# Altium schematic sheet Smart_OBD.SchDoc
size A3
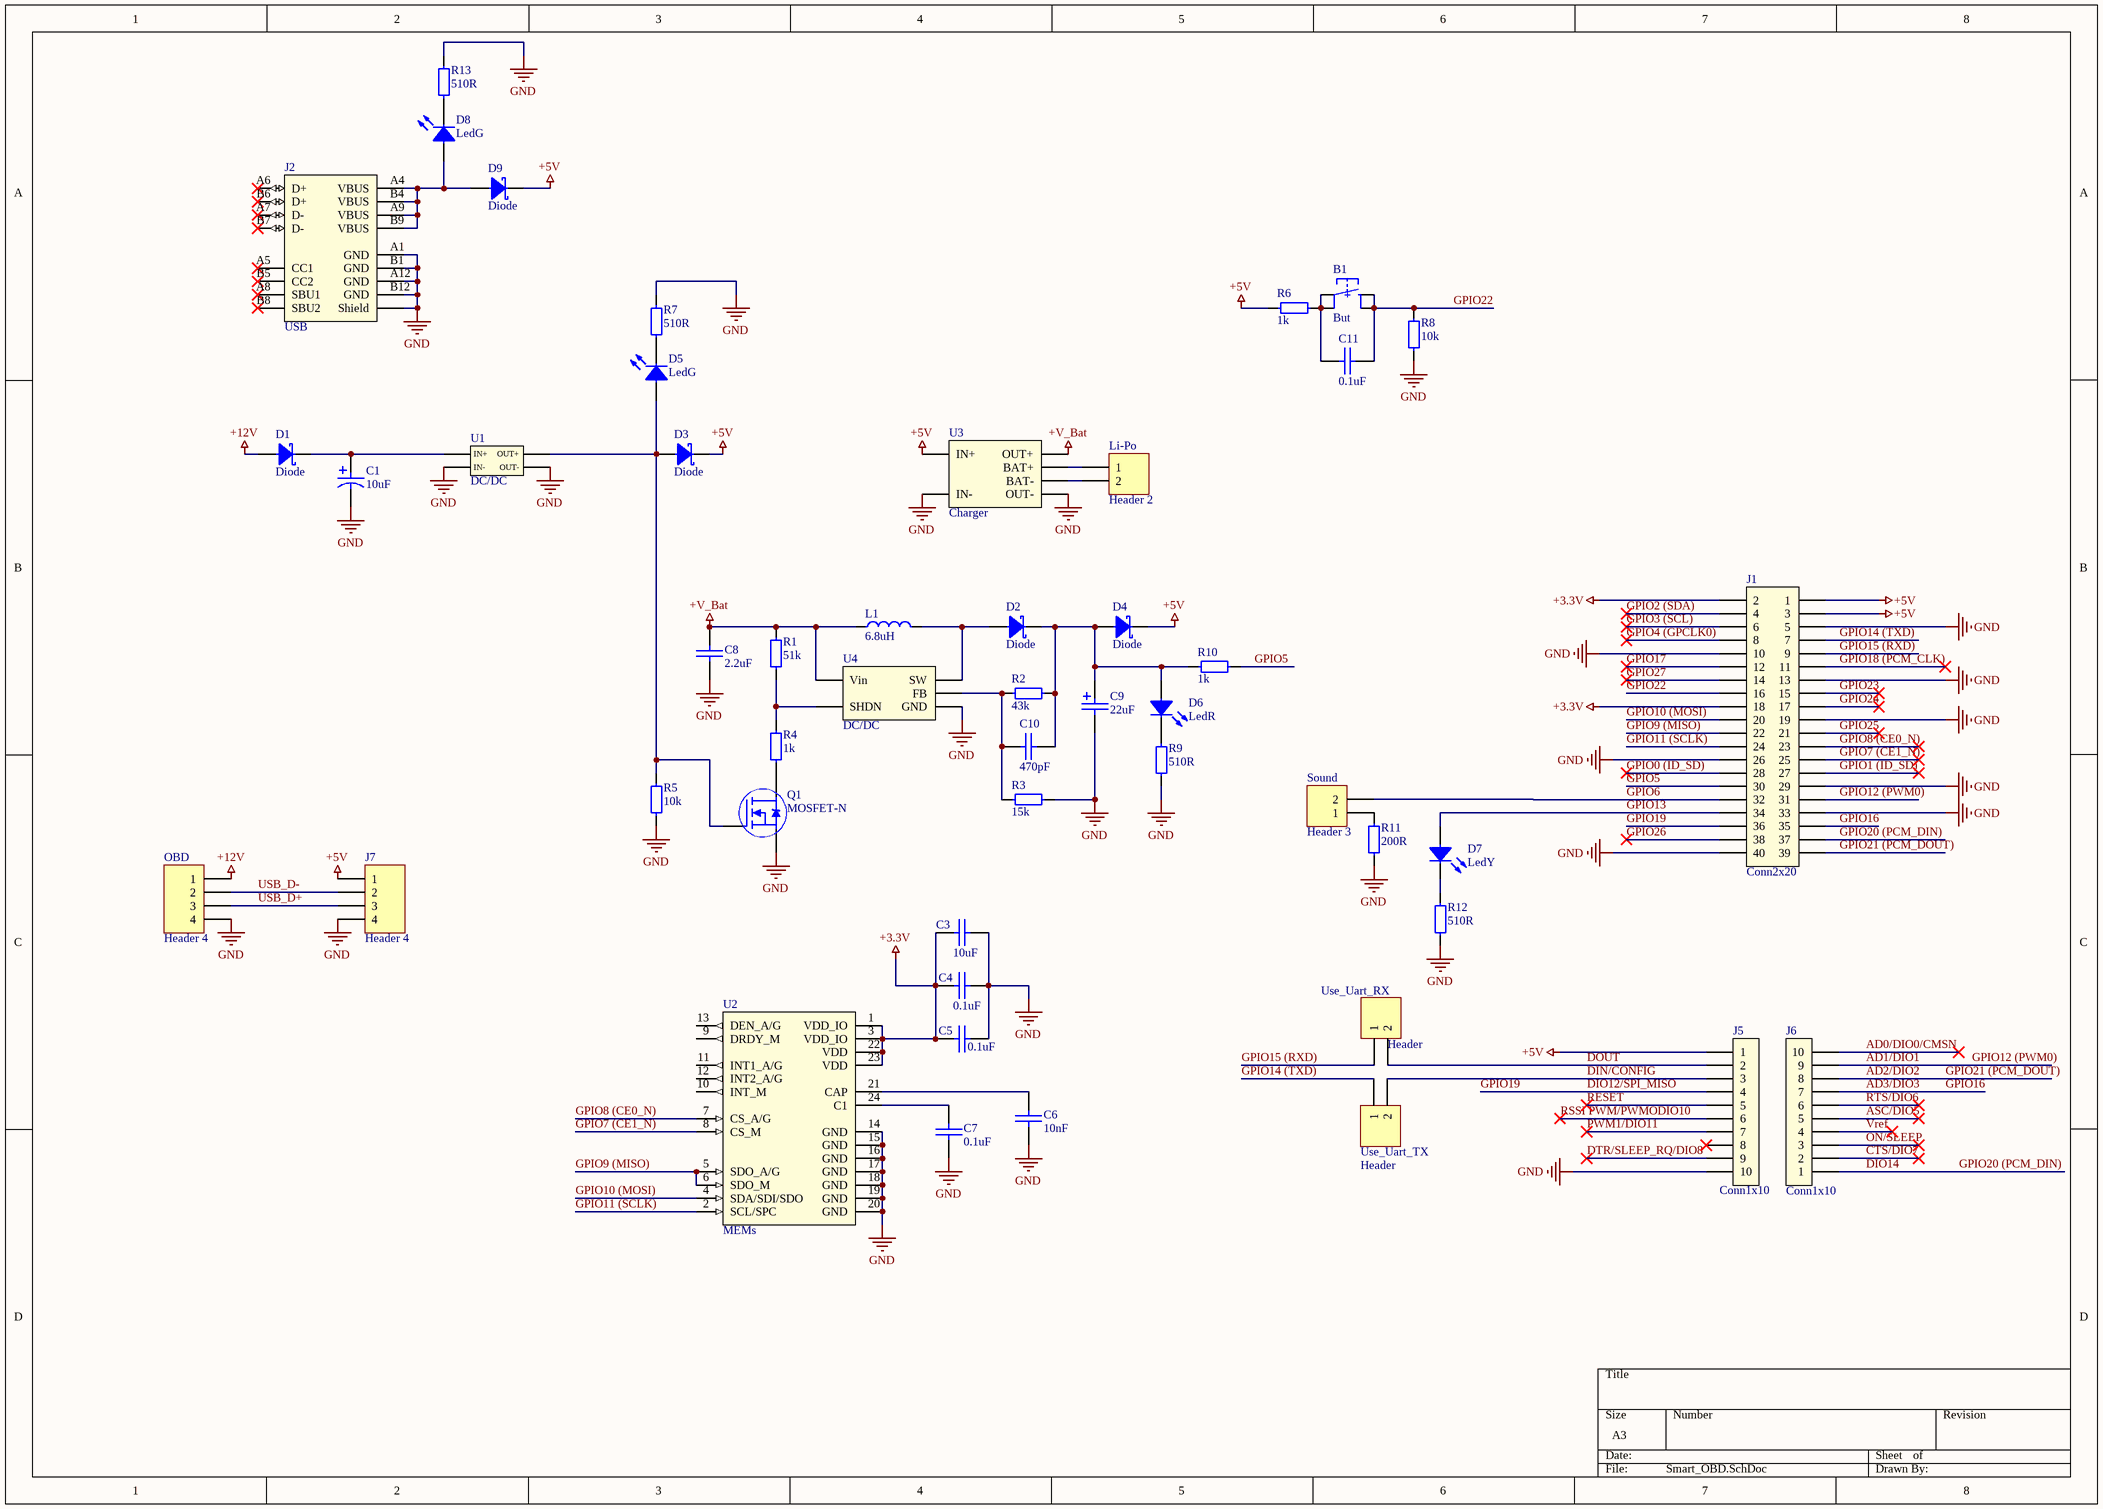
[diagram p0: Smart_OBD.SchDoc]

## Parts
B1  But  [Button 6x6]
C1  10uF  [Bar Cap 5x5.4]
C3  10uF  [0603 Capicator]
C4  0.1uF  [0603 Capicator]
C5  0.1uF  [0603 Capicator]
C6  10nF  [0603 Capicator]
C7  0.1uF  [0603 Capicator]
C8  2.2uF  [0603 Capicator]
C9  22uF  [TANTAL_C_CASE]
C10  470pF  [0603 Capicator]
C11  0.1uF  [0603 Capicator]
D1  Diode  [SMA]
D2  Diode  [SMA]
D3  Diode  [SMA]
D4  Diode  [SMA]
D5  LedG  [0805 LED]
D6  LedR  [0805 LED]
D7  LedY  [0805 LED]
D8  LedG  [0805 LED]
D9  Diode  [SMA]
J1  Conn2x20  [PBD 2x20]
J2  USB  [USB Type-C]
J5  Conn1x10  [PBS2 10]
J6  Conn1x10  [PBS2 10]
J7  Header 4  [HDR1X4]
L1  6.8uH  [Inductor 5.4x5.1]
Li-Po  Header 2  [HDR1X2]
OBD  Header 4  [HDR1X4]
Q1  MOSFET-N  [SOT-23]
R1  51k  [0603 Resistor]
R2  43k  [0603 Resistor]
R3  15k  [0603 Resistor]
R4  1k  [0603 Resistor]
R5  10k  [0603 Resistor]
R6  1k  [0603 Resistor]
R7  510R  [0603 Resistor]
R8  10k  [0603 Resistor]
R9  510R  [0603 Resistor]
R10  1k  [0603 Resistor]
R11  200R  [0603 Resistor]
R12  510R  [0603 Resistor]
R13  510R  [0603 Resistor]
Sound  Header 3  [HDR1X2]
U1  DC/DC  [DC-DC]
U2  MEMs  [LGA 3.5x3x1 mm 24-lead]
U3  Charger  [PW829]
U4  DC/DC  [SOT-23-5]
Use_Uart_RX  Header  [HDR1X2]
Use_Uart_TX  Header  [HDR1X2]

## Nets
+3.3V: C3.1 C4.1 C5.1 J1.2 J1.18 U2.1(VDD_IO) U2.3(VDD_IO) U2.22(VDD) U2.23(VDD)
+5V: D3.2 D4.2 D9.2 J1.1 J1.3 J5.1 J7.1 R6.1 U3.IN+
+12V: D1.1 OBD.1
+V_Bat: C8.2 L1.1 R1.2 U3.OUT+ U4.5(Vin)
GND: C1.1 C3.2 C4.2 C5.2 C6.2 C7.2 C8.1 C9.1 J1.5 J1.10 J1.13 J1.19 J1.26 J1.29 J1.33 J1.40 J2.A(Shield) J2.A1(GND) J2.A12(GND) J2.B1(GND) J2.B12(GND) J5.10 J7.4 OBD.4 Q1.2(Source) R3.2 R5.1 R7.2 R8.1 R9.2 R11.1 R12.2 R13.2 U1.1(IN-) U1.3(OUT-) U2.14(GND) U2.15(GND) U2.16(GND) U2.17(GND) U2.18(GND) U2.19(GND) U2.20(GND) U3.IN- U3.OUT- U4.2(GND)
AD0/DIO0/CMSN: J6.10
AD1/DIO1: J1.31 J6.9  [also labelled GPIO12 (PWM0)]
AD2/DIO2: J1.39 J6.8  [also labelled GPIO21 (PCM_DOUT)]
AD3/DIO3: J1.35 J6.7  [also labelled GPIO16]
ASC/DIO5: J6.5
CTS/DIO7: J6.2
DIN/CONFIG: J5.3 Use_Uart_TX.2
DIO12/SPI_MISO: J1.36 J5.4  [also labelled GPIO19]
DIO14: J1.37 J6.1  [also labelled GPIO20 (PCM_DIN)]
DOUT: J5.2 Use_Uart_RX.2
DTR/SLEEP_RQ/DIO8: J5.9
GPIO0 (ID_SD): J1.28
GPIO1 (ID_SD): J1.27
GPIO2 (SDA): J1.4
GPIO3 (SCL): J1.6
GPIO4 (GPCLK0): J1.8
GPIO5: J1.30 R10.1
GPIO6: J1.32 Sound.2
GPIO7 (CE1_N): J1.25 U2.8(CS_M)
GPIO8 (CE0_N): J1.23 U2.7(CS_A/G)
GPIO9 (MISO): J1.22 U2.5(SDO_A/G) U2.6(SDO_M)
GPIO10 (MOSI): J1.20 U2.4(SDA/SDI/SDO)
GPIO11 (SCLK): J1.24 U2.2(SCL/SPC)
GPIO13: D7.1 J1.34
GPIO14 (TXD): J1.7 Use_Uart_TX.1
GPIO15 (RXD): J1.9 Use_Uart_RX.1
GPIO17: J1.12
GPIO18 (PCM_CLK): J1.11
GPIO22: B1.3 B1.4 C11.2 J1.16 R8.2
GPIO23: J1.15
GPIO24: J1.17
GPIO25: J1.21
GPIO26: J1.38
GPIO27: J1.14
ON/SLEEP: J6.3
PWM1/DIO11: J5.7
RESET: J5.5
RSSI PWM/PWMODIO10: J5.6
RTS/DIO6: J6.6
USB_D+: J7.3 OBD.3
USB_D-: J7.2 OBD.2
Vref: J6.4
NetB1_1: B1.1 B1.2 C11.1 R6.2
NetC1_2: C1.2 D1.2 U1.2(IN+)
NetC6_1: C6.1 U2.21(CAP)
NetC7_1: C7.1 U2.24(C1)
NetC9_2: C9.2 C10.2 D2.2 D4.1 D6.1 R2.2 R10.2
NetC10_1: C10.1 R2.1 R3.1 U4.3(FB)
NetD2_1: D2.1 L1.2 U4.1(SW)
NetD3_1: D3.1 D5.1 Q1.1(Gate) R5.2 U1.4(OUT+)
NetD5_2: D5.2 R7.1
NetD6_2: D6.2 R9.1
NetD7_2: D7.2 R12.1
NetD8_1: D8.1 D9.1 J2.A4(VBUS) J2.A9(VBUS) J2.B4(VBUS) J2.B9(VBUS)
NetD8_2: D8.2 R13.1
NetLi-Po_1: Li-Po.1 U3.B+(BAT+)
NetLi-Po_2: Li-Po.2 U3.B-(BAT-)
NetQ1_3: Q1.3(Drain) R4.1
NetR1_1: R1.1 R4.2 U4.4(SHDN)
NetR11_2: R11.2 Sound.1

Not connected (* = marked no-connect by the designer): J2 A5(CC1)* A6(D+)* A7(D-)* A8(SBU1)* B5(CC2)* B6(D+)* B7(D-)* B8(SBU2)*; J5 8*; U2 9(DRDY_M) 10(INT_M) 11(INT1_A/G) 12(INT2_A/G) 13(DEN_A/G)

## Library data of the parts
B1 = Button 4 Conn: Button 4 Conn SMD; Manufacturer: TE Connectivity; Part Number: 1571563-9; Type: Button; ComponentLink1Description: Chip&Dip; ComponentLink1URL: https://www.chipdip.ru/product/tyco-1571563-9-fsm8jsmatr
C1 = Cap Pol 10uF: ECAP SMD,  35V; Part Number: ECAPSMD10uF/35V; Manufacturer: China; Type: Capacitor; ComponentLink1Description: Chip&Dip; ComponentLink1URL: https://www.chipdip.ru/product0/884555856
C3 = Cap 10uF (0603): 10uF X5R 25V 20% 0603; Manufacturer: Murata Manufacturing; Part Number: GRM188R61E106M; Type: Capacitor; ComponentLink1Description: Chip&Dip; ComponentLink1URL: https://www.chipdip.ru/product/grm188r61e106m
C4 C5 C7 C11 = Cap 0.1uF (0603): 0.1uF X7R 50V 10% 0603; Manufacturer: Murata Manufacturing; Part Number: GRM188R71H104KA93D; Type: Capacitor; ComponentLink1Description: Chip&Dip; ComponentLink1URL: https://www.chipdip.ru/product/grm188r71h104k
C6 = Cap 10nF (0603): X7R 10nF 100V 10% 0603; Manufacturer: Murata Manufacturing; Part Number: GRM188R72A103KA01D; Type: Capacitor; ComponentLink1Description: Chip&Dip; ComponentLink1URL: https://www.chipdip.ru/product/grm188r72a103ka01d
C8 = Cap 2.2uF (0603): 2.2uF X5R 10V 10% 0603; Manufacturer: Murata Manufacturing; Part Number: GRM188R61A225KE34D; Type: Capacitor; ComponentLink1Description: Chip&Dip; ComponentLink1URL: https://www.chipdip.ru/product/grm188r61a225k
C9 = Cap Tantal 22uF (SMDC): TECAP, 22uF, 16V, case C, 10%; Part Number: TECAP22/16VC10; Manufacturer: China; Type: Capacitor; ComponentLink1Description: Chip&Dip; ComponentLink1URL: https://www.chipdip.ru/product0/527359843
C10 = Cap 470pF (0603): 470pF NP0 50V 5% 0603; Manufacturer: Taiwan; Part Number: MLCC470pFNPO50V5%0603; Type: Capacitor; ComponentLink1Description: Chip&Dip; ComponentLink1URL: https://www.chipdip.ru/product0/515359566
D1-D4 D9 = Diode Schottky (SMA): Diode Schottky 3A 40V; Part Number: B340A-E3/61T; Manufacturer: Vishay; Type: Diode; ComponentLink1Description: DataSheet; ComponentLink1URL: https://static.chipdip.ru/lib/652/DOC001652710.pdf; ComponentLink2Description: Chip&Dip; ComponentLink2URL: https://www.chipdip.ru/product/b340a-e3-61t-2
D5 D8 = Led Green: Led Green SMD 1608, 120°, 525nM; Part Number: TO-1608BC-PG; Manufacturer: Taiwan Oasis Technology; Type: Diode; ComponentLink1Description: Chip&Dip; ComponentLink1URL: https://www.chipdip.ru/product/to-1608bc-pg
D6 = Led Red: SMD 1608, 112mcd, 120°, 630nM (Ultra Bright Red); Part Number: TO-1608BC-MRE; Manufacturer: Taiwan Oasis Technology; Type: Diode; ComponentLink1Description: Chip&Dip; ComponentLink1URL: https://www.chipdip.ru/product/to-1608bc-mre
D7 = Led Yellow: SMD 1608, 247mcd, 120°, 592nM (High Bright Yellow); Part Number: TO-1608BC-MYF; Manufacturer: Taiwan Oasis Technology; Type: Diode; ComponentLink1Description: Chip&Dip; ComponentLink1URL: https://www.chipdip.ru/product/to-1608bc-myf
J1 = Conn2x20 (PBD): Female for PLD; Part Number: DS1023-2*20S21; Manufacturer: Ningbo connfly electronic; Type: Connector; ComponentLink1Description: Chip&Dip; ComponentLink1URL: https://www.chipdip.ru/product/pbd-40
J2 = Connector USB 2.0 Type-C: Manufacturer: Global Connector Technology; Part Number: USB4085-GF-A; ComponentLink1Description: Chip&Dip; ComponentLink1URL: https://www.chipdip.ru/product/usb4085-gf-a; Type: Connector; ComponentLink2Description: DataSheet; ComponentLink2URL: https://www.farnell.com/cad/2648880.pdf
J5 J6 = Conn1x10 (PBS2): Female; Part Number: DS1026-01-1*10S8BV; Manufacturer: Ningbo connfly electronic; Type: Connector; ComponentLink1Description: Chip&Dip; ComponentLink1URL: https://www.chipdip.ru/product/pbs2-10
J7 OBD = Header 4: Header, 4-Pin; LatestRevisionDate: 17-Jul-2002; LatestRevisionNote: Re-released for DXP Platform.; Publisher: Altium Limited
L1 = Inductor 6.8uH (4.2A): 6.8uH, 5.4x5.1x2, 4.2A; Part Number: SPM5020T-3R3M-LR; Manufacturer: TDK; Type: Inductor; ComponentLink1Description: DataSheet; ComponentLink1URL: https://static.chipdip.ru/lib/015/DOC004015227.pdf; ComponentLink2Description: Chip&Dip; ComponentLink2URL: SPM5020T-6R8M-LR
Li-Po Sound Use_Uart_RX Use_Uart_TX = Header 2: Header, 2-Pin; LatestRevisionDate: 17-Jul-2002; LatestRevisionNote: Re-released for DXP Platform.; Publisher: Altium Limited
Q1 = MOSFET-N [FDV]: These N-Channel enhancement mode field effect transistors areproduced  using  Fairchild's  proprietary,  high  cell  density,  DMOStechnology.; Part Number: FDV303N; Manufacturer: Fairchild Semiconductor; Type: Transistor; ComponentLink1Description: DataSheet; ComponentLink1URL: https://static.chipdip.ru/lib/009/DOC001009115.pdf; ComponentLink2Description: Chip&Dip; ComponentLink2URL: https://www.chipdip.ru/product/fdv303n
R1 = Res 51k (0603): 0.1W 0603 51k, 1%; Part Number: RC0603FR-0751KL; Manufacturer: Taiwan; Type: Resistor; ComponentLink1Description: Chip&Dip; ComponentLink1URL: https://www.chipdip.ru/product0/9000079753
R2 = Res 43k (0603): 0.1W 0603 43k, 1%; Part Number: RC0603FR-0743KL; Manufacturer: Taiwan; Type: Resistor; ComponentLink1Description: Chip&Dip; ComponentLink1URL: https://www.chipdip.ru/product0/9000079751
R3 = Res 15k (0603): 0.1W 0603 15k, 1%; Part Number: RC0603FR-0715KL; Manufacturer: Taiwan; Type: Resistor; ComponentLink1Description: Chip&Dip; ComponentLink1URL: https://www.chipdip.ru/product0/9000079740
R4 R6 R10 = Res 1k (0603): 0.1W 0603 1k, 1%; Part Number: RC0603FR-071KL; Manufacturer: Taiwan; Type: Resistor; ComponentLink1Description: Chip&Dip; ComponentLink1URL: https://www.chipdip.ru/product0/9000079676
R5 R8 = Res 10k (0603): 0.1W 0603 10k, 1%; Part Number: RC0603FR-0710KL; Manufacturer: Taiwan; Type: Resistor; ComponentLink1Description: Chip&Dip; ComponentLink1URL: https://www.chipdip.ru/product0/9000079736
R7 R9 R12 R13 = Res 510R (0603): 0.1W 0603 510R, 1%; Part Number: RC0603FR-07510RL; Manufacturer: Taiwan; Type: Resistor; ComponentLink1Description: Chip&Dip; ComponentLink1URL: https://www.chipdip.ru/product0/9000079669
R11 = Res 200R (0603): 0.1W 0603 200R, 1%; Part Number: RC0603FR-07200RL; Manufacturer: Taiwan; Type: Resistor; ComponentLink1Description: Chip&Dip; ComponentLink1URL: https://www.chipdip.ru/product0/9000079623
U1 = DC/DC: DC/DC 5V with MP2307 Chip
U2 = MEMs 9 Axis: System-in-package featuring a 3D digital linear acceleration sensor, a 3D digital angular rate sensor, and a 3D digital magnetic sensor; Manufacturer: STMicroelectronics; Part Number: LSM9DS1TR; ComponentLink1Description: DataSheet; ComponentLink1URL: https://static.chipdip.ru/lib/427/DOC004427868.pdf; ComponentLink2Description: Chip&Dip; ComponentLink2URL: https://www.chipdip.ru/product/lsm9ds1tr; Type: IC
U3 = Charger [PW829]: Charger for Li-Ion; Manufacturer: Master Kit; Part Number: PW829; ComponentLink2Description: Chip&Dip; ComponentLink2URL: https://www.chipdip.ru/product0/8002091037; Type: IC
U4 = DC/DC Controller [LM2731]: The  LM2731  switching  regulators  are  current-mode  boostconverters  operating  at  fixed  frequencies  of  1.6  MHz  (“X”option) and 600 kHz (“Y” option).; Manufacturer: Texas Instruments; Part Number: LM2731YMF/NOPB; ComponentLink1Description: Chip&Dip; ComponentLink1URL: https://www.chipdip.ru/product/lm2731ymf-nopb; ComponentLink2Description: DataSheet; ComponentLink2URL: https://static.chipdip.ru/lib/491/DOC000491907.pdf; Type: IC